# EAGLE design 7segclock (EAGLE 9.5.2)
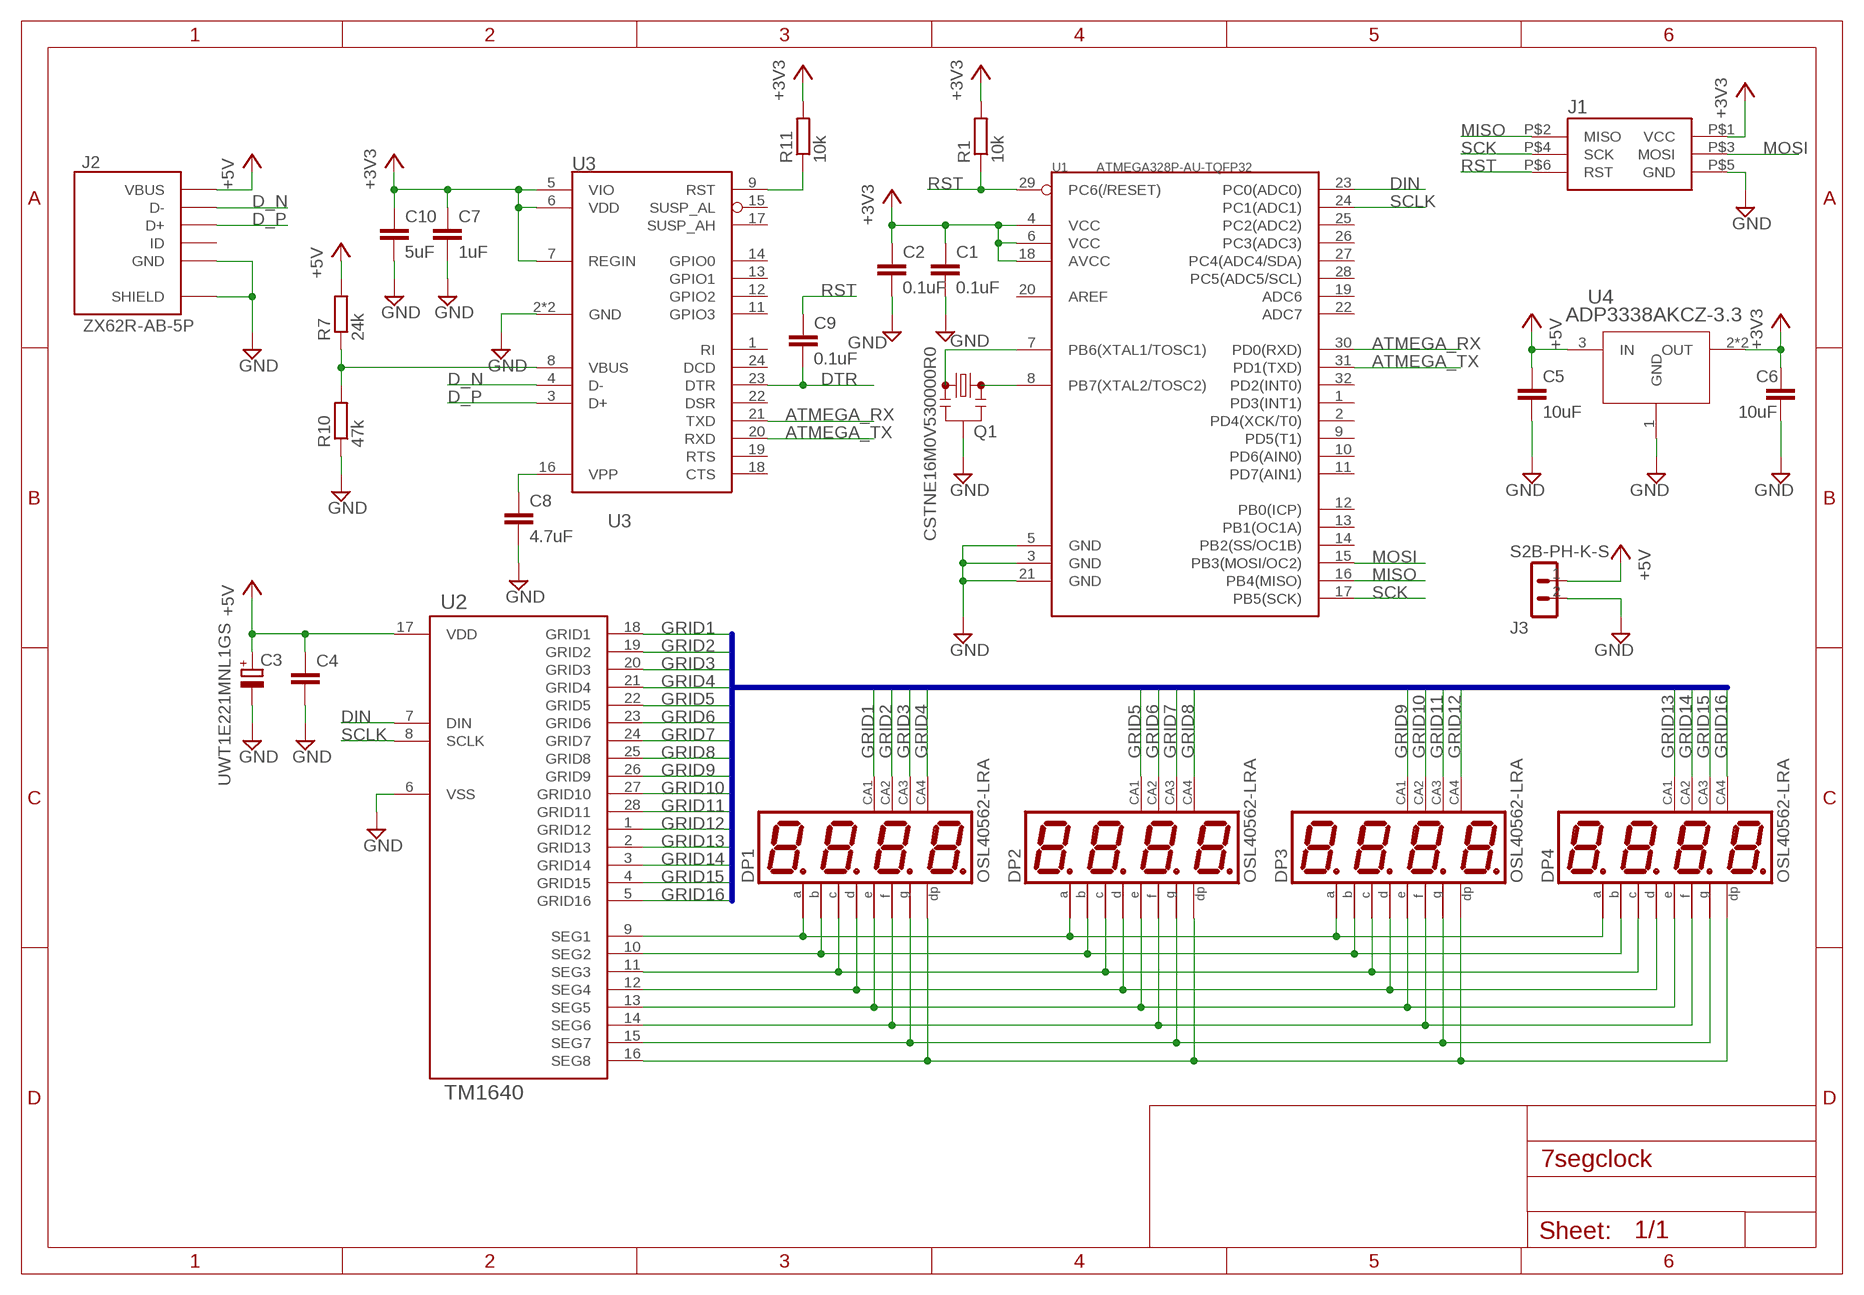
[diagram p0: schematic, sheet 1]

## Parts
C1  0.1uF  C-EUC0603  [C0603]
C2  0.1uF  C-EUC0603  [C0603]
C3  UWT1E221MNL1GS  [NICHICON-ALMINUM-CAPACITOR-8MM]
C4  C-EUC0603  [C0603]
C5  10uF  C-EUC0603  [C0603]
C6  10uF  C-EUC0603  [C0603]
C7  1uF  C-EUC0603  [C0603]
C8  4.7uF  C-EUC0603  [C0603]
C9  0.1uF  C-EUC0603  [C0603]
C10  5uF  C-EUC0603  [C0603]
DP1  OSL40562-LRA  [OSL40562-LRA]
DP2  OSL40562-LRA  [OSL40562-LRA]
DP3  OSL40562-LRA  [OSL40562-LRA]
DP4  OSL40562-LRA  [OSL40562-LRA]
J1  ICSP  [PIN_HEADER_MALE_2X03_06P]
J2  ZX62R-AB-5P  [ZX62R-B-5PA]
J3  S2B-PH-K-S  [S2B-PH-K-S]
Q1  CSTNE16M0V530000R0  [CSTNE16M0V530000R0]
R1  10k  R-EU_R0603  [R0603]
R7  24k  R-EU_R0603  [R0603]
R10  47k  R-EU_R0603  [R0603]
R11  10k  R-EU_R0603  [R0603]
U1  ATMEGA328P-AU-TQFP32  MCU-ATMEGA328P-AU(TQFP32)  [TQFP32-0.8-7X7MM]
U2  TM1640  [SOP28-TITANMICROELECTRONICS]
U3  CP2104  [QFN24-SILABS]
U4  ADP3338AKCZ-3.3  [SOT233]

## Nets
+3V3: C1.1 C2.1 C6.1 C7.1 C10.1 J1.P$1(VCC) R1.2 R11.2 U1.4(VCC) U1.6(VCC) U1.18(AVCC) U3.5(VIO) U3.6(VDD) U3.7(REGIN) U4.2(OUT) U4.4(OUT)
+5V: C3.POS(+) C4.1 C5.1 J2.VCC(VBUS) J3.1 R7.2 U2.17(VDD) U4.3(IN)
ATMEGA_RX: U1.30(PD0(RXD)) U3.21(TXD)
ATMEGA_TX: U1.31(PD1(TXD)) U3.20(RXD)
D_N: J2.D- U3.4(D-)
D_P: J2.D+ U3.3(D+)
DIN: U1.23(PC0(ADC0)) U2.7(DIN)
DTR: C9.2 U3.23(DTR)
GND: C1.2 C2.2 C3.NEG(-) C4.2 C5.2 C6.2 C7.2 C8.2 C10.2 J1.P$5(GND) J2.GND J2.SHIELD@1(SHIELD) J2.SHIELD@2(SHIELD) J2.SHIELD@3(SHIELD) J2.SHIELD@4(SHIELD) J3.2 Q1.2 R10.1 U1.3(GND) U1.5(GND) U1.21(GND) U2.6(VSS) U3.2(GND) U3.25(GND) U4.1(GND)
GRID1 [LED GRID]: DP1.DIG1(CA) U2.18(GRID1)
GRID2 [LED GRID]: DP1.DIG2(CA) U2.19(GRID2)
GRID3 [LED GRID]: DP1.DIG3(CA) U2.20(GRID3)
GRID4 [LED GRID]: DP1.DIG4(CA) U2.21(GRID4)
GRID5 [LED GRID]: DP2.DIG1(CA) U2.22(GRID5)
GRID6 [LED GRID]: DP2.DIG2(CA) U2.23(GRID6)
GRID7 [LED GRID]: DP2.DIG3(CA) U2.24(GRID7)
GRID8 [LED GRID]: DP2.DIG4(CA) U2.25(GRID8)
GRID9 [LED GRID]: DP3.DIG1(CA) U2.26(GRID9)
GRID10 [LED GRID]: DP3.DIG2(CA) U2.27(GRID10)
GRID11 [LED GRID]: DP3.DIG3(CA) U2.28(GRID11)
GRID12 [LED GRID]: DP3.DIG4(CA) U2.1(GRID12)
GRID13 [LED GRID]: DP4.DIG1(CA) U2.2(GRID13)
GRID14 [LED GRID]: DP4.DIG2(CA) U2.3(GRID14)
GRID15 [LED GRID]: DP4.DIG3(CA) U2.4(GRID15)
GRID16 [LED GRID]: DP4.DIG4(CA) U2.5(GRID16)
MISO: J1.P$2(MISO) U1.16(PB4(MISO))
MOSI: J1.P$3(MOSI) U1.15(PB3(MOSI/OC2))
N$1: DP1.A DP2.A DP3.A DP4.A U2.9(SEG1)
N$2: DP1.B DP2.B DP3.B DP4.B U2.10(SEG2)
N$3: DP1.C DP2.C DP3.C DP4.C U2.11(SEG3)
N$4: DP1.D DP2.D DP3.D DP4.D U2.12(SEG4)
N$5: DP1.E DP2.E DP3.E DP4.E U2.13(SEG5)
N$6: DP1.F DP2.F DP3.F DP4.F U2.14(SEG6)
N$7: DP1.G DP2.G DP3.G DP4.G U2.15(SEG7)
N$8: DP1.DP DP2.DP DP3.DP DP4.DP U2.16(SEG8)
N$9: C8.1 U3.16(VPP)
N$10: Q1.3 U1.8(PB7(XTAL2/TOSC2))
N$11: Q1.1 U1.7(PB6(XTAL1/TOSC1))
N$12: R7.1 R10.2 U3.8(VBUS)
N$13: R11.1 U3.9(RST)
RST: C9.1 J1.P$6(RST) R1.1 U1.29(PC6(/RESET))
SCK: J1.P$4(SCK) U1.17(PB5(SCK))
SCLK: U1.24(PC1(ADC1)) U2.8(SCLK)
Unconnected: J2.ID U1.1(PD3(INT1)) U1.2(PD4(XCK/T0)) U1.9(PD5(T1)) U1.10(PD6(AIN0)) U1.11(PD7(AIN1)) U1.12(PB0(ICP)) U1.13(PB1(OC1A)) U1.14(PB2(SS/OC1B)) U1.19(ADC6) U1.20(AREF) U1.22(ADC7) U1.25(PC2(ADC2)) U1.26(PC3(ADC3)) U1.27(PC4(ADC4/SDA)) U1.28(PC5(ADC5/SCL)) U1.32(PD2(INT0)) U3.1(RI) U3.11(GPIO3) U3.12(GPIO2) U3.13(GPIO1) U3.14(GPIO0) U3.15(SUSP_AL) U3.17(SUSP_AH) U3.18(CTS) U3.19(RTS) U3.22(DSR) U3.24(DCD)

## Buses
GRID[1..16]

## Library data of the parts
C1 C2 C4-C10 = taki-library:C-EU: CAPACITOR, European symbol
C3 = taki-library:UWT1E221MNL1GS
DP1-DP4 = taki-library:OSL40562-LRA
J1 = taki-library:ICSP
J2 = taki-library:ZX62
J3 = taki-library:S2B-PH-K-S
Q1 = taki-library:CSTNE16M0V530000R0
R1 R7 R10 R11 = taki-library:R-EU_: RESISTOR, European symbol
U1 = taki-library:MCU-ATMEGA328P-AU(TQFP32): 310010049; MPN: ATMEGA328P-AU
U2 = taki-library:TM1640
U3 = taki-library:CP2104
U4 = taki-library:ADP3338AKCZ-3.3

## Net classes
0 default: width 0.005 mm
1 POWER: width 0.254 mm
2 LED GRID: width 0.406 mm

## Board
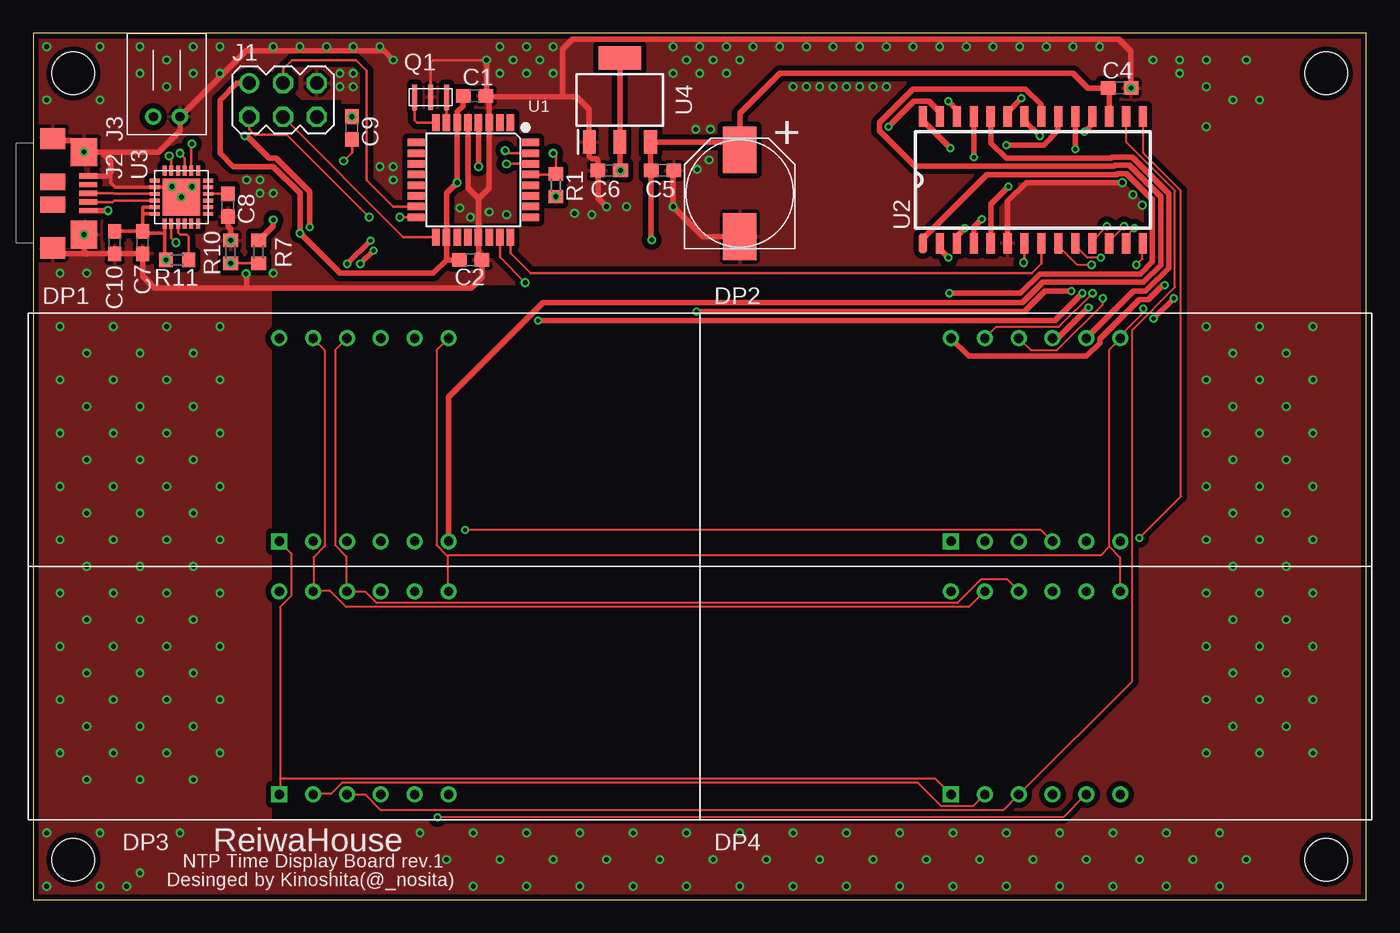
[diagram p1: board, top side]
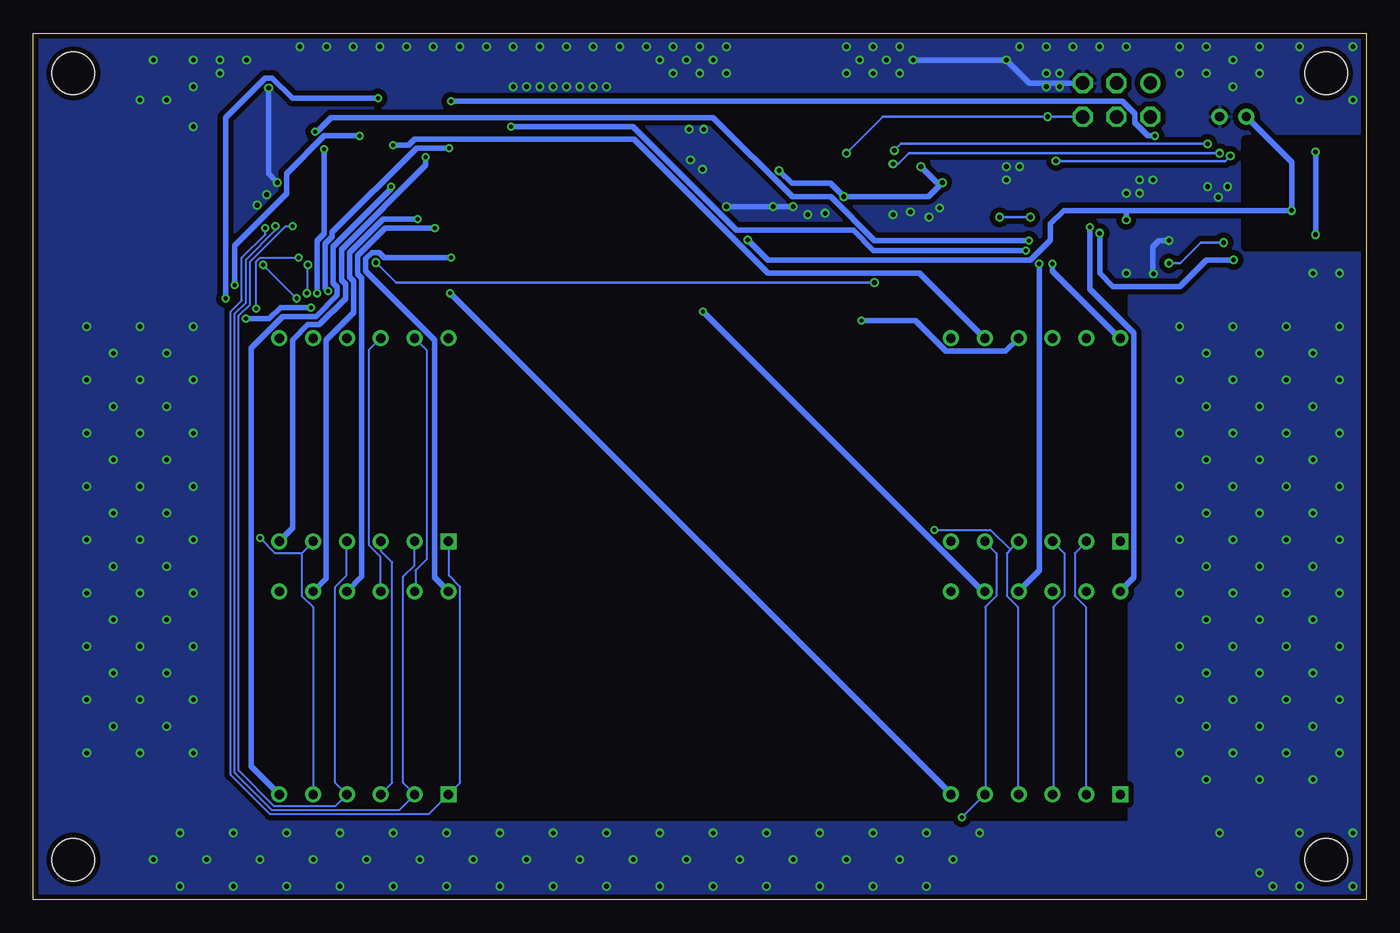
[diagram p2: board, bottom side, seen from below]

Size 100 x 65 mm. Coordinates in mm from the lower left corner, seen from the top.
Outline: 0,0 100,0 100,65 0,65 0,0
Copper layers (1*16): Top 0.035mm / dielectric 1.5mm / Bottom 0.035mm
Design rules "Elecrow_2-layer_eagle_rule": minimum track width 6mil, minimum drill 12mil, track to track 6mil, track to pad 6mil, pad to pad 6mil, via to via 6mil, smd to smd 0mil, copper to edge 10mil, drill to drill 10mil, minimum pad ring 10mil, minimum via ring 6mil, stop-mask expansion 2mil, vias tented up to drill 100mil, thermal gap 10mil
Holes 3.2 mm at 3,3 97,3 3,62 97,62
bRestrict: area 0,49 to 9,57

### Footprints (pad centres in the part's own frame; a part is rotated, then mirrored left to right if it is on the bottom)
C0603 = smd 1.1 x 1: 1 -0.85,0; 2 0.85,0
NICHICON-ALMINUM-CAPACITOR-8MM = smd 2.5 x 3.5: NEG 0,-3.25; POS 0,3.25
OSL40562-LRA = drill 0.7: A -3.81,7.62; B 6.35,7.62; C 1.27,-7.62; D -3.81,-7.62; DIG1 -6.35,7.62; DIG2 1.27,7.62; DIG3 3.81,7.62; DIG4 6.35,-7.62; DP -1.27,-7.62; F -1.27,7.62; G 3.81,-7.62 | drill 0.7 square: E -6.35,-7.62
PIN_HEADER_MALE_2X03_06P = drill 1: P$1 -3.81,1.27 | drill 1 octagon: P$2 -3.81,-1.27; P$3 -1.27,1.27; P$4 -1.27,-1.27; P$5 1.27,1.27; P$6 1.27,-1.27
ZX62R-B-5PA = smd 0.4 x 1.35: D+ 0,2.675; D- 0.65,2.675; GND -1.3,2.675; ID -0.65,2.675; VCC 1.3,2.675 | smd 1.2 x 1.9: NC@1 -0.85,0; NC@2 0.85,0 | smd 2.1 x 2: SHIELD@1 -3.1,2.35; SHIELD@2 3.1,2.35 | smd 1.6 x 1.9: SHIELD@3 -4.1,0; SHIELD@4 4.1,0
S2B-PH-K-S = drill 0.7: 1 -1,0; 2 1,0
CSTNE16M0V530000R0 = smd 0.4 x 1.9: 1 1.2,0; 2 0,0; 3 -1.2,0
R0603 = smd 1 x 1.1: 1 -0.85,0; 2 0.85,0
TQFP32-0.8-7X7MM = smd 1.27 x 0.559: 1 -4.293,2.8; 2 -4.293,2; 3 -4.293,1.2; 4 -4.293,0.4; 5 -4.293,-0.4; 6 -4.293,-1.2; 7 -4.293,-2; 8 -4.293,-2.8; 17 4.293,-2.8; 18 4.293,-2; 19 4.293,-1.2; 20 4.293,-0.4; 21 4.293,0.4; 22 4.293,1.2; 23 4.293,2; 24 4.293,2.8 | smd 0.559 x 1.27: 9 -2.8,-4.293; 10 -2,-4.293; 11 -1.2,-4.293; 12 -0.4,-4.293; 13 0.4,-4.293; 14 1.2,-4.293; 15 2,-4.293; 16 2.8,-4.293; 25 2.8,4.293; 26 2,4.293; 27 1.2,4.293; 28 0.4,4.293; 29 -0.4,4.293; 30 -1.2,4.293; 31 -2,4.293; 32 -2.8,4.293
SOP28-TITANMICROELECTRONICS = smd 0.61 x 1.512: 1 -8.255,-4.756; 2 -6.985,-4.756; 3 -5.715,-4.756; 4 -4.445,-4.756; 5 -3.175,-4.756; 6 -1.905,-4.756; 7 -0.635,-4.756; 8 0.635,-4.756; 9 1.905,-4.756; 10 3.175,-4.756; 11 4.445,-4.756; 12 5.715,-4.756; 13 6.985,-4.756; 14 8.255,-4.756; 15 8.255,4.756; 16 6.985,4.756; 17 5.715,4.756; 18 4.445,4.756; 19 3.175,4.756; 20 1.905,4.756; 21 0.635,4.756; 22 -0.635,4.756; 23 -1.905,4.756; 24 -3.175,4.756; 25 -4.445,4.756; 26 -5.715,4.756; 27 -6.985,4.756; 28 -8.255,4.756
QFN24-SILABS = smd 0.75 x 0.3: 1 -2,1.25; 2 -2,0.75; 3 -2,0.25; 4 -2,-0.25; 5 -2,-0.75; 6 -2,-1.25; 13 2,-1.25; 14 2,-0.75; 15 2,-0.25; 16 2,0.25; 17 2,0.75; 18 2,1.25 | smd 0.3 x 0.75: 7 -1.25,-2; 8 -0.75,-2; 9 -0.25,-2; 10 0.25,-2; 11 0.75,-2; 12 1.25,-2; 19 1.25,2; 20 0.75,2; 21 0.25,2; 22 -0.25,2; 23 -0.75,2; 24 -1.25,2 | smd 2.8 x 2.8: 25 0,0
SOT233 = smd 1.75 x 0.95: 1 -3.15,2.3; 2 -3.15,0; 3 -3.15,-2.3 | smd 1.75 x 3.2: 4 3.15,0

### Placement (x,y rotation side)
C1  33.1,60.3 0 top
C2  32.8,48 0 top
C3  53,53 0 top
C4  81.5,60.9 0 top
C5  47.2,54.7 0 top
C6  43.2,54.7 180 top
C7  8.2,49.3 270 top
C8  14.6,52.1 270 top
C9  23.9,57.9 270 top
C10  6.1,49.3 270 top
DP1  24.8,34.5 0 top
DP2  75.2,34.5 0 top
DP3  24.8,15.5 0 top
DP4  75.2,15.5 0 top
J1  20,60 0 top
J2  1.45,53 270 top
J3  10,58.75 0 top
Q1  29.8,60.2 0 top
R1  39.2,53.6 270 top
R7  16.9,48.6 90 top
R10  14.8,48.6 270 top
R11  10.8,48 180 top
U1  33,54 270 top
U2  75,54 0 top
U3  11.1,52.7 0 top
U4  44,60 90 top

### Tracks (layer width: path | path; a pad name or v marks a point on that pad's centre or on a via)
+3V3  (via drill 0.35)
  Top 0.254: U3.5 8.25,51.95 8.2,51.9 8.2,51.3 | 8.2,51.3 C7.1 8,50.15 | U3.6 8.35,51.45 8.2,51.3 | C10.1 8,50.15 | R11.2 9.85,48.1 9.85,50 | 9.85,50 U3.7 | 9.85,50 8.15,50 8,50.15
  Top 0.406: C1.1 32.25,59.55 31.8,59.1 U1.6 v31.8,53.8 31,53 U1.18 31,48.2 | 31,48.2 31.2,48 C2.1 | J1.P$1 15.27,61.27 14,60 14,56 15,55 18,55 20,53 v20,50 23,47 30,47 31,48 31,48.2 | C6.1 44,54.75 U4.2 U4.4 | U1.4 v33.4,55
  Bottom 0.406: R11.2 12,48 14,46 19,46 20,47 v20,50 | C6.1 43.1,53.75 40.2,53.75 R1.2 32.85,52.75 v31.8,53.8 32.2,53.8 v33.4,55
  other vias: 9.95,48 39.2,52.75 44.05,54.7
+5V  (via drill 0.35)
  Top 0.254: 80.72,59 U2.17
  Top 0.406: J2.VCC v5.6,51.7 | v46.4,49.5 46.35,49.5 C5.1 46.3,54.75 U4.3 52.4,56.85 C3.POS 53,59 56,62 78,62 79.1,60.9 C4.1 80.72,60.84 80.72,59 | R7.2 18,50.55 v18,51
  Bottom 0.406: 18,51.7 v5.6,51.7 5.6,55.35 J3.1 | 18,51.7 22.7,51.7 23.7,50.7 23.7,49.5 25.2,48 44.9,48 v46.4,49.5 | v18,51 18,51.7
ATMEGA_RX  (via drill 0.35)
  Top 0.203: U3.21 11.35,55.65 v11,56 | v35.5,55.2 U1.30
  Bottom 0.203: v35.5,55.2 35.1,55.2 34.3,56 v11,56
ATMEGA_TX  (via drill 0.35)
  Top 0.203: U1.31 35.6,56 v35.4,56.2 | U3.20 11.85,56.65 v11.9,56.7
  Bottom 0.203: v35.4,56.2 34.9,56.7 v11.9,56.7
D_N
  Top 0.203: U3.4 6.05,52.45 5.95,52.35 J2.D-
D_P
  Top 0.203: U3.3 6.05,52.95 6,53 J2.D+
DIN  (via drill 0.35)
  Top 0.203: U1.23 35,48.2 v36.9,46.3 | v74.3,47.8 74.36,47.87 U2.7
  Bottom 0.203: v36.9,46.3 72.8,46.3 v74.3,47.8
DTR  (via drill 0.35)
  Top 0.203: C9.2 23.9,56.04 v23.28,55.42 | v10.19,55.8 10.35,55.64 U3.23
  Bottom 0.203: v23.28,55.42 10.57,55.42 v10.19,55.8
GND  (via drill 0.35)
  Top 0.152: U3.25 11.05,52.73 11.05,52.88 11,53
  Top 0.203: 34,60.25 C1.2 | Q1.2 29.8,62.8 30,63 v34,63
  Top 0.254: 5.8,54.6 5.8,53.8 6.15,53.45 U3.2 10.55,53.45 11,53
  Top 0.406: R10.1 14.8,50.3 14.6,50.5 C8.2 | 4,48.45 C10.2 C7.2 8.2,46.8 9.1,45.9 16,45.9 | 4,48.45 1.9,48.45 J2.SHIELD@4 | 4,48.45 3.8,48.65 J2.SHIELD@2 | J2.SHIELD@3 1.6,56.95 3.53,56.95 3.65,56.83 3.65,56.25 J2.SHIELD@1 | J2.GND 5.5,54.3 5.8,54.6 5.8,55.4 5.1,56.1 J2.SHIELD@1 | 33.4,52.6 U1.21 33.4,48.25 C2.2 33.65,46.7 32.85,45.9 16,45.9 | U1.5 32.6,53.4 33.4,52.6 | 33.4,52.6 34.2,53.4 U1.3 34.2,60.05 34,60.25 | v34,63 34,60.25 | J2.SHIELD@1 9.4,56.1 11,57.7 J3.2 15.95,63.7 26.3,63.7 v27,63 | C3.NEG 50.25,49.75 v48,52 48,54.65 C5.2 | 39.7,60.25 40.75,60.25 41.7,59.3 U4.1 41.7,55.8 41.9,55.6 42.2,55.6 42.35,55.45 C6.2 42.35,52.65 v43,52 | 39.7,60.25 34,60.25 | v15.96,46.96 16,46.92 16,45.9 | C4.2 82.35,63.65 81.46,64.54 40.44,64.54 39.7,63.8 39.7,60.25 | U2.6 73.09,52.4 74.5,53.8 v81.7,53.8
  Bottom 0.406: J1.P$5 25.27,61.27 v27,63 v34,63 | v43,52 v48,52 | J2.SHIELD@1 J2.SHIELD@2 | R10.1 15.55,49.45 16,49 16,47 v15.96,46.96 | v81.7,53.8 82.35,54.45 C4.2
  other vias: 3.8,56.1 3.8,49.9 14.8,49.45 82.35,60.9 8,64 10,63 12,64 12,62 8,62 10,61 2,43 4,41 2,39 4,37 6,39 6,43 8,41 10,43 10,39 12,41 14,43 14,39 12,37 8,37 2,35 4,33 2,31 4,29 6,31 6,35 8,33 10,35 10,31 12,33 14,35 14,31 12,29 8,29 2,27 4,25 2,23 4,21 6,23 6,27 8,25 10,27 10,23 12,25 14,27 14,23 12,21 8,21 2,19 4,17 2,15 4,13 6,15 6,19 8,17 10,19 10,15 12,17 14,19 14,15 12,13 8,13 88,43 90,41 88,39 90,37 92,39 92,43 94,41 94,37 88,35 90,33 88,31 90,29 92,31 92,35 94,33 94,29 88,27 90,25 88,23 90,21 92,23 92,27 94,25 94,21 88,19 90,17 88,15 90,13 92,15 92,19 94,17 94,13 44.5,52 50.7,55.5 49.8,54.8 48,64 48,62 49,63 50,64 50,62 51,63 52,64 52,62 53,63 54,64 56,64 58,64 60,64 62,64 64,64 66,64 68,64 70,64 72,64 74,64 76,64 78,64 80,64 84,63 82.5,52.9 83.2,52.1 40.6,51.5 41.9,51.4 49.7,57.8 50.8,57.8 35,64 37,64 36,63 35,62 37,62 38,63 39,64 39,62 26,55 27,55 27,54 24,61 24,62 23,62 23,61 14,64 14,62 18,64 16,54 17,54 17,53 18,53 18,47 4,47 2,47 1,60 1,64 5,64 5,60 29,5 31,3 33,5 33,1 35,3 37,5 37,1 39,3 43,3 41,5 41,1 45,5 45,1 47,3 49,5 49,1 51,3 53,5 53,1 55,3 57,5 57,1 59,3 61,5 61,1 63,3 67,3 65,5 65,1 69,5 69,1 71,3 73,5 73,1 75,3 77,5 77,1 79,3 81,5 81,1 83,3 85,5 85,1 32,51.9 32.8,51.2 34.2,51.6 35.5,51.4 57,61 58,61 59,61 60,61 61,61 62,61 63,61 64,61 10.4,53.5 11.9,53.5 11.1,52.7 20,64 22,64 24,64 26,64 5,5 5,1 1,1 1,5 8,2 7,1 11,5 10,11 6,11 14,11 2,11 4,9 8,9 12,9 87,3 89,5 89,1 91,3 92,11 88,11 96,11 96,15 96,19 96,23 96,27 96,31 96,35 96,39 96,43 86,62 86,63 88,63 88,61 88,58 90,60 91,63 92,60
  pour Bottom (isolate 0.4): -2,0 -2,65 100,65 100,0
  pour Top (isolate 0.4): -1,0 -1,65 100,65 100,0
  cutout Bottom: 18,6 70,6 70,46 18,46
  cutout Top: 18,6 70,6 70,46 18,46
  cutout Top: 15,62 15,56 23,56 23,59.9 20.1,59.9 19,61 19,62
GRID1  (via drill 0.3)
  Top 0.406: v78.87,57.61 79.4,58.14 79.4,58.75 U2.18 | v23.55,47.7 v25.3,49.45
  Bottom 0.406: v78.87,57.61 78.72,57.61 77.65,58.67 49,58.67 43.05,52.73 40.16,52.73 36.88,49.45 v25.3,49.45 | v23.55,47.7 23.55,47.17 18.52,42.14 DP1.DIG1
GRID2  (via drill 0.3)
  Top 0.406: v78.18,56.31 U2.19 | v78.72,45.49 76.66,43.43 v37.87,43.43
  Bottom 0.406: v78.18,56.31 78.18,49.99 78.72,49.45 v78.72,45.49 | v37.87,43.43 33.83,43.43 31.55,41.15 27.05,41.15 26.14,42.06 DP1.DIG2
GRID3  (via drill 0.3)
  Top 0.406: v73,56.62 75.82,56.62 76.89,57.68 76.89,58.75 U2.20
  Bottom 0.406: v73,56.62 71.86,56.62 71.4,57.07 54.94,57.07 44.88,47.02 33.53,47.02 28.65,42.14 DP1.DIG3
GRID4
  Top 0.406: U2.21 75.59,58.83 75.59,59.66 74.45,60.81 65.99,60.81 63.48,58.29 63.48,57.68 66.14,55.02 81.08,55.02 81.15,55.09 82.22,55.09 84.58,52.73 84.58,47.62 83.29,46.33 75.74,46.33 74.22,44.81 38.25,44.81 31.17,37.72 31.17,26.9 DP1.DIG4
GRID5  (via drill 0.3)
  Top 0.406: v75.51,57.3 74.37,58.45 U2.22 | v84.89,46.1 84.73,46.1 83.67,45.03 82.98,45.03 80.01,42.06 80.01,41.76 79.02,40.77 70.18,40.77 68.89,42.06 DP2.DIG1
  Bottom 0.406: v75.51,57.3 78.18,57.3 81,54.48 81,52.96 84.89,49.07 v84.89,46.1
GRID6  (via drill 0.3)
  Top 0.406: v74.14,60.12 73.15,59.13 73.15,58.83 U2.23 | v84.05,43.59 v85.57,45.11 | v79.17,44.42 76.89,42.14 76.5,42.14 DP2.DIG2
  Bottom 0.406: v74.14,60.12 80.54,60.12 82.07,61.65 82.6,61.65 85.57,58.67 v85.57,45.11 | v84.05,43.59 82.3,43.59 81.46,44.42 v79.17,44.42
GRID7
  Top 0.406: U2.24 71.86,58.75 71.86,56.77 73,55.63 80.85,55.63 80.92,55.7 82.45,55.7 85.19,52.96 85.19,47.4 83.44,45.64 82.53,45.64 79.02,42.14 DP2.DIG3
GRID8  (via drill 0.3)
  Top 0.406: v70.56,55.7 U2.25
  Bottom 0.406: v70.56,55.7 70.56,55.09 76.89,48.77 76.89,46.48 76.58,46.18 76.58,45.11 78.56,43.13 79.4,43.13 80.54,41.99 80.54,27.89 81.53,26.9 DP2.DIG4
GRID9  (via drill 0.3)
  Top 0.406: v68.66,59.89 69.27,59.28 69.27,58.83 U2.26 | v15.85,57.3 16,57.3 17.68,55.63 18.21,55.63 20.73,53.11 v20.73,50.44
  Bottom 0.406: v68.66,59.89 18.29,59.89 17.37,58.98 17.37,58.29 16.38,57.3 v15.85,57.3 | v20.73,50.44 20.73,45.8 17.45,42.52 17.45,24.16 18.44,23.16 DP3.DIG1
GRID10  (via drill 0.3)
  Top 0.406: v64.16,57.99 66.06,59.89 67.21,59.89 67.97,59.13 67.97,58.83 U2.27 | v24.54,47.7 v25.53,48.69
  Bottom 0.406: v64.16,57.99 55.02,57.99 47.24,50.22 38.48,50.22 36.96,48.69 v25.53,48.69 | v24.54,47.7 24.54,24.69 26.06,23.16 DP3.DIG2
GRID11  (via drill 0.3)
  Top 0.406: v68.81,56.39 66.75,58.45 U2.28 | v77.88,45.64 75.89,45.64 74.37,44.12 v49.76,44.12
  Bottom 0.406: v68.81,56.39 71.25,56.39 77.57,50.06 77.57,49.76 78.11,49.23 78.11,45.87 v77.88,45.64 | v49.76,44.12 28.8,23.16 28.65,23.16 DP3.DIG3
GRID12  (via drill 0.3)
  Top 0.406: v68.73,45.49 74.07,45.49 75.51,46.94 83.06,46.94 83.97,47.85 83.97,52.5 81.99,54.48 81.38,54.48 81.31,54.41 71.55,54.41 66.75,49.61 66.75,49.3 U2.1
  Bottom 0.406: v68.73,45.49 31.17,7.92 DP3.DIG4
GRID13  (via drill 0.3)
  Top 0.406: v68.66,48.16 68.05,48.77 68.05,49.23 U2.2
  Bottom 0.406: v68.66,48.16 73.69,48.16 74.07,48.54 74.6,48.54 75.06,48.08 75.06,47.17 69.88,41.99 69.88,24.16 68.89,23.16 DP4.DIG1
GRID14  (via drill 0.3)
  Top 0.406: v69.88,50.37 69.34,49.84 69.34,49.3 U2.3
  Bottom 0.406: v69.88,50.37 73.61,50.37 75.67,48.31 75.67,46.94 75.36,46.63 75.36,24.23 76.43,23.16 DP4.DIG2
GRID15  (via drill 0.3)
  Top 0.406: v71.17,51.05 70.56,50.44 70.56,49.3 U2.4
  Bottom 0.406: v71.17,51.05 73.76,51.05 76.28,48.54 76.28,46.71 75.97,46.41 75.97,44.04 78.03,41.99 78.03,24.08 78.94,23.16 DP4.DIG3
GRID16  (via drill 0.3)
  Top 0.406: v73.15,53.49 71.86,52.2 71.86,49.3 U2.5
  Bottom 0.406: v73.15,53.49 73.15,53.34 77.5,49 77.5,46.25 77.19,45.95 77.19,45.34 78.79,43.74 81.31,43.74 83.67,41.38 83.67,9.98 81.61,7.92 DP4.DIG4
MISO  (via drill 0.35)
  Top 0.203: v25.2,51.2 24.52,51.88 24.52,51.9 19.02,57.4 16.6,57.4 16.19,57.81 J1.P$2 | v27.5,51.2 U1.16
  Bottom 0.203: v27.5,51.2 v25.2,51.2
MOSI
  Top 0.203: U1.15 27,52 25,54 25,62.2 24.2,63 19.4,63 18.73,62.33 J1.P$3
N$1  (via drill 0.3)
  Top 0.152: DP1.A 21.03,42.06 21.87,41.22 21.87,26.52 21.03,25.68 21.03,23.16 DP3.A 21.11,23.16 22.25,23.16 23.47,21.95 70.18,21.95 71.32,23.09 DP4.A | v79.4,47.62 78.33,47.62 76.96,49 76.96,49.23 U2.9 | v79.48,45.49 76.96,42.98 72.24,42.98 71.4,42.14 DP2.A
  Bottom 0.152: v79.4,47.62 79.4,45.57 v79.48,45.49 | DP4.A 71.32,23.16 71.32,24.69 70.48,25.53 70.48,41.22 71.32,42.06 DP2.A
N$2  (via drill 0.3)
  Top 0.152: 31.05,25.79 30.25,26.59 30.25,41.22 31.09,42.06 DP1.B | 31.05,25.79 31.09,25.76 31.09,23.16 DP3.B | v80.09,48.16 79.1,48.16 78.18,49.07 78.18,49.23 U2.10 | v83.29,44.35 83.29,44.04 81.61,42.37 81.61,42.14 DP2.B 81.53,42.06 80.7,41.22 80.7,26.52 80.73,26.48 | 80.73,26.48 81.53,25.68 81.53,23.16 DP4.B | 80.73,26.48 80.09,25.83 31.09,25.83 31.05,25.79
  Bottom 0.152: v80.09,48.16 82.98,48.16 83.29,47.85 v83.29,44.35
N$3  (via drill 0.3)
  Top 0.152: v80.54,50.52 79.48,49.45 79.48,49.3 U2.11 | v32.38,27.74 75.59,27.74 76.43,26.9 DP2.C
  Bottom 0.152: 26.71,26.25 26.14,26.82 DP1.C | 26.71,26.25 26.98,25.98 26.98,22.78 26.14,21.95 26.14,7.92 DP3.C | v80.54,50.52 81.08,50.52 83.74,47.85 83.74,44.65 84.58,43.81 84.58,9.68 81.92,7.01 77.34,7.01 76.5,7.85 DP4.C 76.5,7.92 77.34,8.76 77.34,23.47 76.5,24.31 76.5,26.82 DP2.C | 26.71,26.25 28.19,27.74 v32.38,27.74
N$4  (via drill 0.3)
  Top 0.152: v81.84,50.52 80.77,49.45 80.77,49.3 U2.12 | DP3.D 21.03,7.92 22.33,7.92 23.16,8.76 66.37,8.76 68.12,7.01 70.48,7.01 71.32,7.85 DP4.D
  Bottom 0.152: DP3.D 21.03,7.92 21.03,21.95 21.87,22.78 21.87,25.98 21.03,26.82 DP1.D | v81.84,50.52 81.84,50.22 84.05,48.01 84.05,44.81 84.89,43.97 84.89,9.53 82.07,6.71 72.54,6.71 71.4,7.85 DP4.D 71.4,7.92 72.24,8.76 72.24,24.23 71.4,25.07 71.4,26.82 DP2.D
N$5  (via drill 0.3)
  Top 0.152: 18.52,9.07 18.52,21.95 19.36,22.78 19.36,25.98 18.52,26.82 DP1.E | 18.52,9.07 18.52,7.92 DP3.E | v82.6,50.37 81.99,49.76 81.99,49.3 U2.13 | 18.52,9.07 67.67,9.07 68.81,7.92 DP4.E
  Bottom 0.152: v82.6,50.37 82.6,49.91 84.35,48.16 84.35,44.96 85.19,44.12 85.19,9.37 82.22,6.4 70.33,6.4 68.89,7.85 DP4.E 68.81,7.92 67.97,8.76 67.97,23.47 68.81,24.31 68.81,26.82 DP2.E
N$6  (via drill 0.3)
  Top 0.152: DP1.F 23.47,42.06 22.63,41.22 22.63,26.59 23.47,25.76 23.47,23.16 DP3.F 23.55,23.09 24.92,23.09 25.76,22.25 69.34,22.25 71.09,24 73.08,24 73.91,23.16 DP4.F | v82.75,47.62 83.21,48.08 83.21,49.23 U2.14 | v80.24,45.11 80.24,44.65 76.81,41.22 74.83,41.22 73.99,42.06 DP2.F
  Bottom 0.152: v80.24,45.11 v82.75,47.62 | DP4.F 73.99,23.16 73.99,25.76 74.83,26.59 74.83,41.22 73.99,42.06 DP2.F
N$7  (via drill 0.3)
  Top 0.152: v82.98,27.13 86.11,30.25 86.11,53.19 83.29,56.01 83.29,58.75 U2.15 | v30.33,6.17 77.27,6.17 78.94,7.85 DP4.G
  Bottom 0.152: DP1.G 28.57,26.82 27.74,25.98 27.74,22.78 28.57,21.95 28.57,7.92 DP3.G 28.65,7.85 v30.33,6.17 | v82.98,27.13 81.84,25.98 79.86,25.98 | 79.86,25.98 79.02,26.82 DP2.G | 79.86,25.98 79.86,22.78 79.02,21.95 79.02,7.92 DP4.G
N$8
  Top 0.152: U2.16 81.99,56.84 85.65,53.19 85.65,45.95 82.45,42.75 82.45,16.38 73.99,7.92 DP4.DP 73.91,7.85 72.77,6.71 26.06,6.71 24.92,7.85 23.55,7.85 DP3.DP
  Bottom 0.152: DP3.DP 23.47,7.92 23.47,21.95 22.63,22.78 22.63,25.98 23.47,26.82 DP1.DP | DP2.DP 73.91,26.82 73.91,26.14 73.08,25.3 73.08,8.76 73.91,7.92 DP4.DP
N$9
  Top 0.203: U3.16 C8.1
N$10
  Top 0.203: Q1.3 28.6,58.5 28.81,58.29 U1.8
N$11
  Top 0.203: Q1.1 U1.7
N$12  (via drill 0.35)
  Top 0.203: U3.8 10.35,49.65 v10.7,49.3 | R10.2 R7.1
  Bottom 0.203: v10.7,49.3 12.4,49.3 13.95,47.75 R10.2
  other vias: 14.8,47.75
N$13
  Top 0.203: U3.9 10.85,50.05 11,49.9 11.5,49.9 11.65,49.75 R11.1
RST  (via drill 0.35)
  Top 0.203: U1.29 39.15,54.4 R1.1 39.2,55.8 v39,56
  Bottom 0.203: J1.P$6 23,58.73 23.88,58.73 | 23.88,58.73 36.27,58.73 v39,56 | C9.1 23.88,58.73
  other vias: 23.9,58.75
SCK
  Top 0.203: J1.P$4 27.75,49.71 U1.17
SCLK
  Top 0.203: U1.24 35.8,48.5 37.3,47 74.9,47 75.64,47.73 U2.8

### Text on the board
tPlace: ReiwaHouse | NTP Time Display Board rev.1 | Desinged by Kinoshita(@_nosita)